# EAGLE design board_UNIVERSAL (EAGLE 9.3.0)
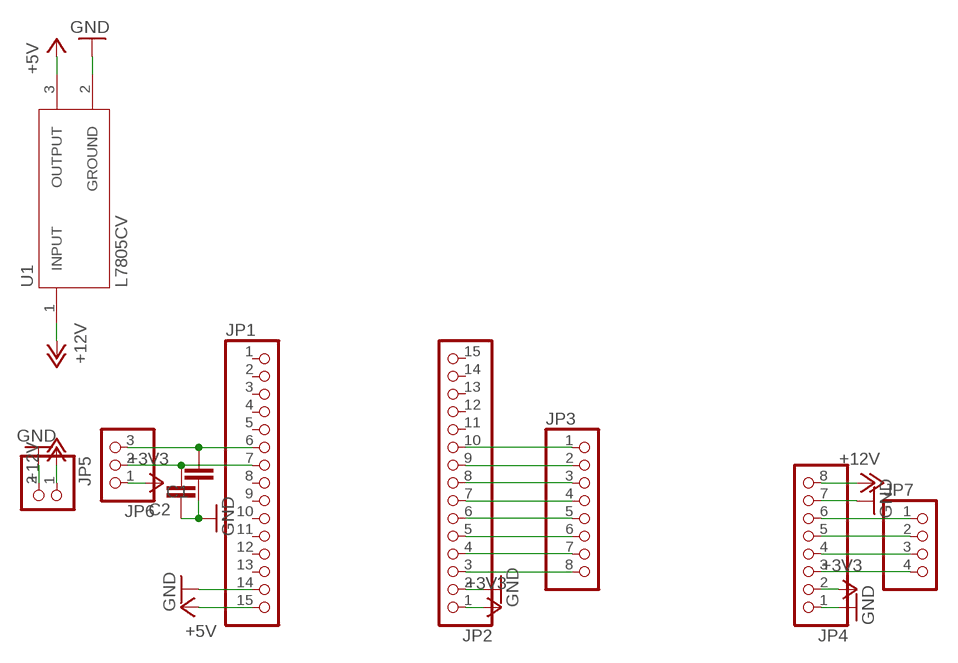
[diagram p0: schematic, sheet 1]

## Parts
C1  C-EU025-030X050  [C025-030X050]
C2  C-EU025-030X050  [C025-030X050]
JP1  PINHD-1X15  [1X15]
JP2  PINHD-1X15  [1X15]
JP3  PINHD-1X8  [1X08]
JP4  PINHD-1X8  [1X08]
JP5  PINHD-1X2  [1X02]
JP6  PINHD-1X3  [1X03]
JP7  PINHD-1X4  [1X04]
U1  L7805CV  [TO255P1040X460X1968-3]

## Nets
+3V3: JP2.1 JP4.2 JP6.1
+5V: JP1.15 U1.3(OUTPUT)
+12V: JP4.8 JP5.1 U1.1(INPUT)
GND: C1.1 C2.1 JP1.14 JP2.2 JP4.1 JP4.7 JP5.2 U1.2(GROUND)
N$1: C2.2 JP1.7 JP6.2
N$2: C1.2 JP1.6 JP6.3
N$3: JP2.10 JP3.1
N$4: JP2.8 JP3.3
N$5: JP2.7 JP3.4
N$6: JP2.6 JP3.5
N$7: JP2.9 JP3.2
N$8: JP4.6 JP7.1
N$9: JP4.5 JP7.2
N$10: JP4.4 JP7.3
N$11: JP4.3 JP7.4
N$12: JP2.5 JP3.6
N$13: JP2.4 JP3.7
N$14: JP2.3 JP3.8
Unconnected: JP1.1 JP1.2 JP1.3 JP1.4 JP1.5 JP1.8 JP1.9 JP1.10 JP1.11 JP1.12 JP1.13 JP2.11 JP2.12 JP2.13 JP2.14 JP2.15

## Library data of the parts
C1 C2 = rcl:C-EU: CAPACITOR, European symbol; SPICEPREFIX: C
JP1 JP2 = pinhead:PINHD-1X15: PIN HEADER
JP3 JP4 = pinhead:PINHD-1X8: PIN HEADER
JP5 = pinhead:PINHD-1X2: PIN HEADER
JP6 = pinhead:PINHD-1X3: PIN HEADER
JP7 = pinhead:PINHD-1X4: PIN HEADER
U1 = L7805CV:L7805CV: Standard Regulator Pos 5V 1.5A 3-Pin(3+Tab) TO-220 Standard Regulator Pos 5V 1.5A 3-Pin(3+Tab) TO-220; AVAILABILITY: Unavailable; DESCRIPTION: Linear Voltage Regulator IC 1 Output 1.5A TO-220; MF: STMicroelectronics; MP: L7805CV; PACKAGE: TO-220 STMicroelectronics; PRICE: None

## Board
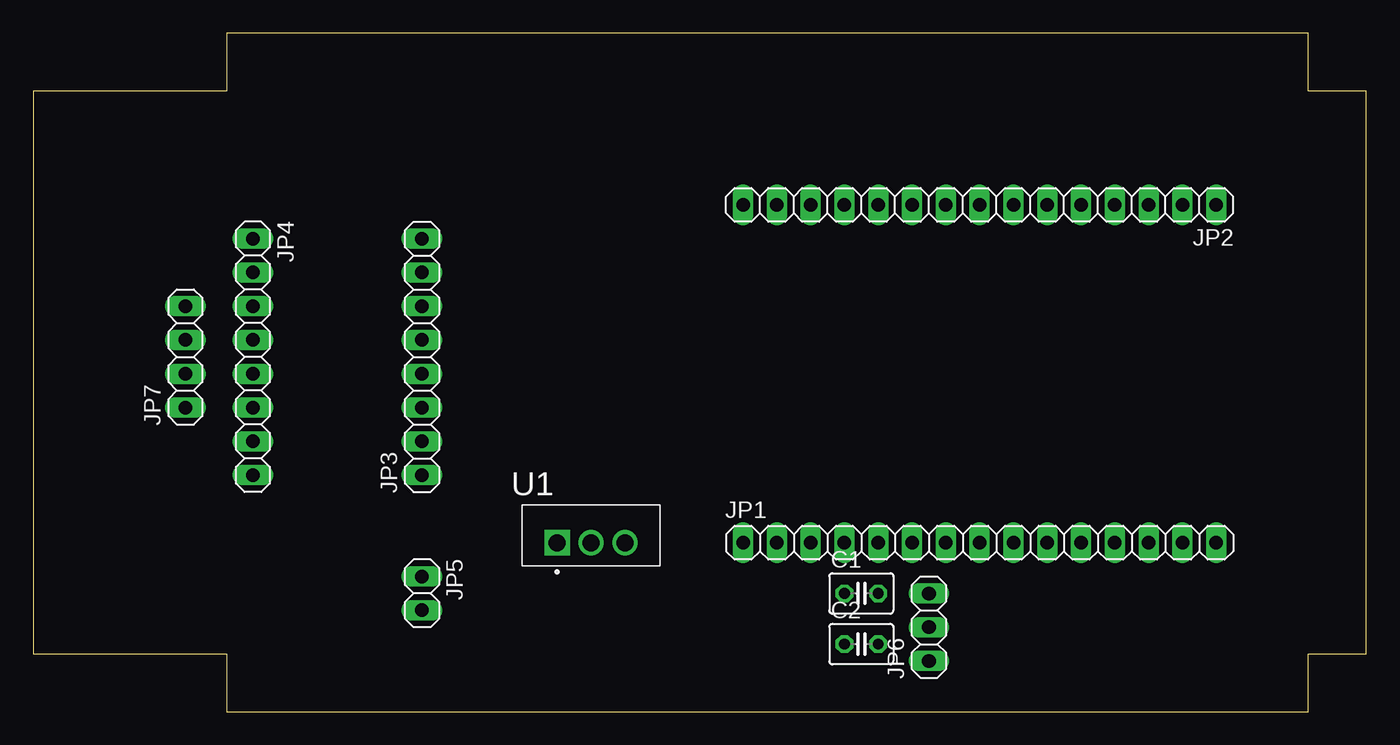
[diagram p1: board, top side]
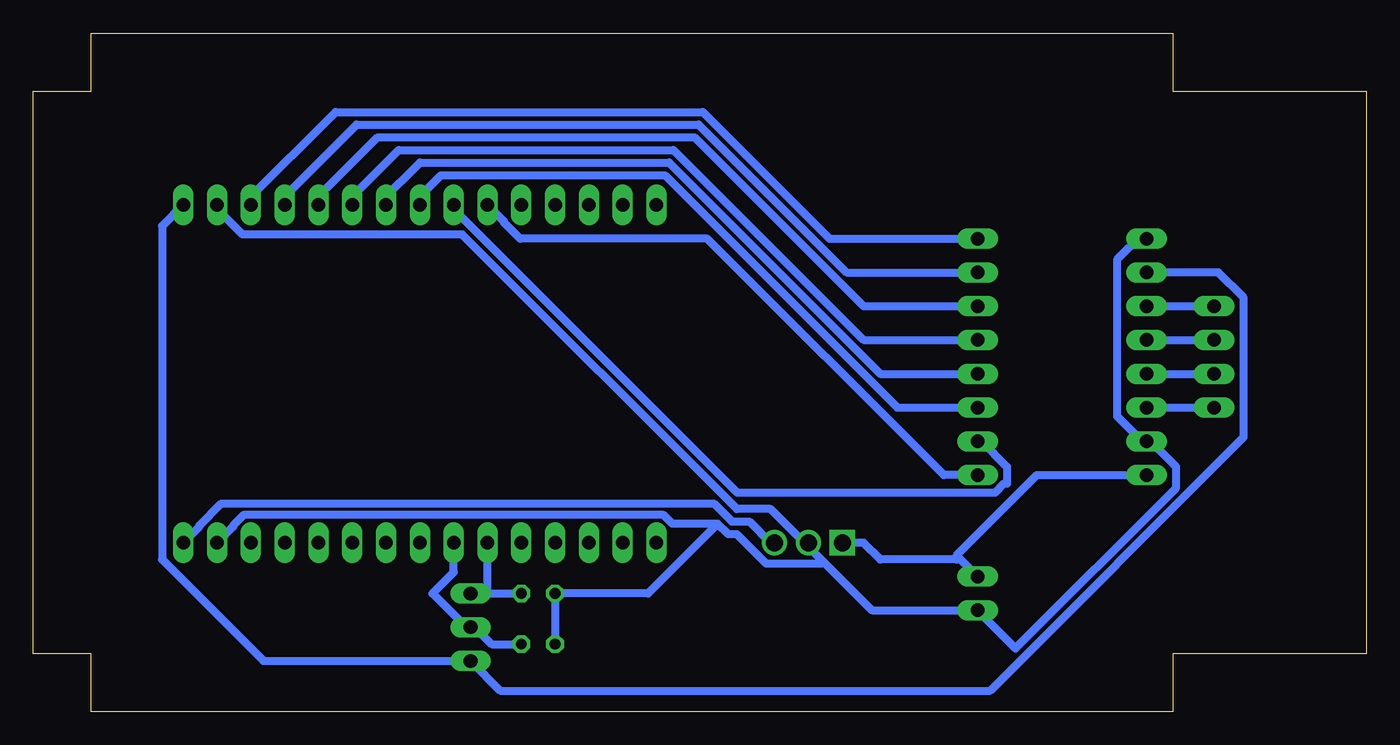
[diagram p2: board, bottom side, seen from below]

Size 100.18 x 51 mm. Coordinates in mm from the lower left corner, seen from the top.
Outline: 14.53,51 14.53,46.65 0,46.65 0,4.35 14.53,4.35 14.53,0 95.83,0 95.83,4.35 100.17,4.35 100.17,46.65 95.83,46.65 95.83,51 14.53,51
Copper layers (1*16): Top 0.035mm / dielectric 1.5mm / Bottom 0.035mm
Design rules "default *": minimum track width 24mil, minimum drill 0.35mm, track to track 10mil, track to pad 10mil, pad to pad 6mil, via to via 6mil, smd to smd 6mil, copper to edge 40mil, drill to drill 6mil, minimum pad ring 10mil, minimum via ring 8mil, stop-mask expansion 4mil, vias tented up to drill 0mil, thermal gap 10mil

### Footprints (pad centres in the part's own frame; a part is rotated, then mirrored left to right if it is on the bottom)
C025-030X050 = drill 0.813 octagon: 1 -1.27,0; 2 1.27,0
1X15 = drill 1.016 long: 1 -17.78,0; 2 -15.24,0; 3 -12.7,0; 4 -10.16,0; 5 -7.62,0; 6 -5.08,0; 7 -2.54,0; 8 0,0; 9 2.54,0; 10 5.08,0; 11 7.62,0; 12 10.16,0; 13 12.7,0; 14 15.24,0; 15 17.78,0
1X08 = drill 1.016 long: 1 -8.89,0; 2 -6.35,0; 3 -3.81,0; 4 -1.27,0; 5 1.27,0; 6 3.81,0; 7 6.35,0; 8 8.89,0
1X02 = drill 1.016 long: 1 -1.27,0; 2 1.27,0
1X03 = drill 1.016 long: 1 -2.54,0; 2 0,0; 3 2.54,0
1X04 = drill 1.016 long: 1 -3.81,0; 2 -1.27,0; 3 1.27,0; 4 3.81,0
TO255P1040X460X1968-3 = drill 1.27 pad 1.91 square: 1 0,0 | drill 1.27 pad 1.91: 2 2.55,0; 3 5.1,0

### Placement (x,y rotation side)
C1  62.23,8.89 0 top
C2  62.23,5.08 0 top
JP1  71.12,12.7 0 top
JP2  71.12,38.1 180 top
JP3  29.21,26.67 90 top
JP4  16.51,26.67 270 top
JP5  29.21,8.89 270 top
JP6  67.31,6.35 90 top
JP7  11.43,26.67 90 top
U1  39.37,12.7 0 top

### Tracks (layer width: path | path; a pad name or v marks a point on that pad's centre or on a via)
+3V3
  Bottom 0.61: JP2.1 90.49,36.51 90.49,11.43 82.87,3.81 JP6.1 65.09,1.59 28.26,1.59 9.21,20.64 9.21,31.11 11.11,33.02 JP4.2
+5V
  Bottom 0.61: 88.9,13.65 JP1.15 87.68,13.92 87.68,14.01 86.04,15.65 49.03,15.65 47.67,14.29 46.35,14.29 44.77,12.7 U1.3
+12V
  Bottom 0.61: JP4.8 24.77,17.78 30.8,11.75 30.64,11.59 | JP5.1 30.64,11.59 | U1.1 37.78,12.7 36.51,11.43 30.8,11.43 30.64,11.59
GND
  Bottom 0.61: JP4.1 16.83,35.88 18.73,33.97 18.73,22.23 16.83,20.32 JP4.7 16.19,20.32 14.29,18.41 14.29,16.83 26.35,4.76 JP5.2 37.15,7.62 40.8,11.27 | C2.1 C1.1 53.98,8.89 48.74,14.13 | 42.23,12.7 40.8,11.27 | 86.36,13.65 JP1.14 85.14,13.92 85.14,14.01 84.37,14.78 52.79,14.78 52.14,14.13 48.74,14.13 | 48.74,14.13 47.94,13.34 47.31,13.34 45.09,11.11 40.96,11.11 40.8,11.27 | JP2.2 86.36,37.78 84.45,35.88 67.94,35.88 47.31,15.24 44.77,15.24 42.23,12.7 | 42.23,12.7 U1.2
N$1
  Bottom 0.61: C2.2 65.72,5.08 66.99,6.35 JP6.2 67.63,6.35 70.17,8.89 68.58,10.48 JP1.7
N$2
  Bottom 0.61: 66.04,8.89 C1.2 | 66.04,8.89 JP1.6 | 66.04,8.89 JP6.3
N$3
  Bottom 0.61: JP3.1 31.75,17.78 49.53,35.56 63.59,35.56 64.82,36.79 64.82,36.88 JP2.10
N$4
  Bottom 0.61: JP3.3 35.24,22.86 52.7,40.32 69.53,40.32 71.44,38.42 JP2.8
N$5
  Bottom 0.61: JP3.4 36.51,25.4 52.39,41.27 71.12,41.27 73.98,38.42 JP2.7
N$6
  Bottom 0.61: JP3.5 37.78,27.94 52.07,42.23 72.71,42.23 76.52,38.42 JP2.6
N$7
  Bottom 0.61: JP3.2 28.89,20.32 26.99,18.41 26.99,17.14 27.21,17.14 27.9,16.46 47.26,16.46 68.58,37.78 JP2.9
N$8
  Bottom 0.61: JP4.6 JP7.1
N$9
  Bottom 0.61: JP4.5 JP7.2
N$10
  Bottom 0.61: JP4.4 JP7.3
N$11
  Bottom 0.61: JP4.3 JP7.4
N$12
  Bottom 0.61: JP3.6 37.78,30.48 50.48,43.18 74.3,43.18 79.06,38.42 JP2.5
N$13
  Bottom 0.61: JP3.7 39.05,33.02 50.16,44.13 75.88,44.13 81.6,38.42 JP2.4
N$14
  Bottom 0.61: JP3.8 40.32,35.56 49.85,45.09 77.47,45.09 84.14,38.42 JP2.3